# Altium schematic sheet Sheet_1.schdoc
size 273 x 185 mm
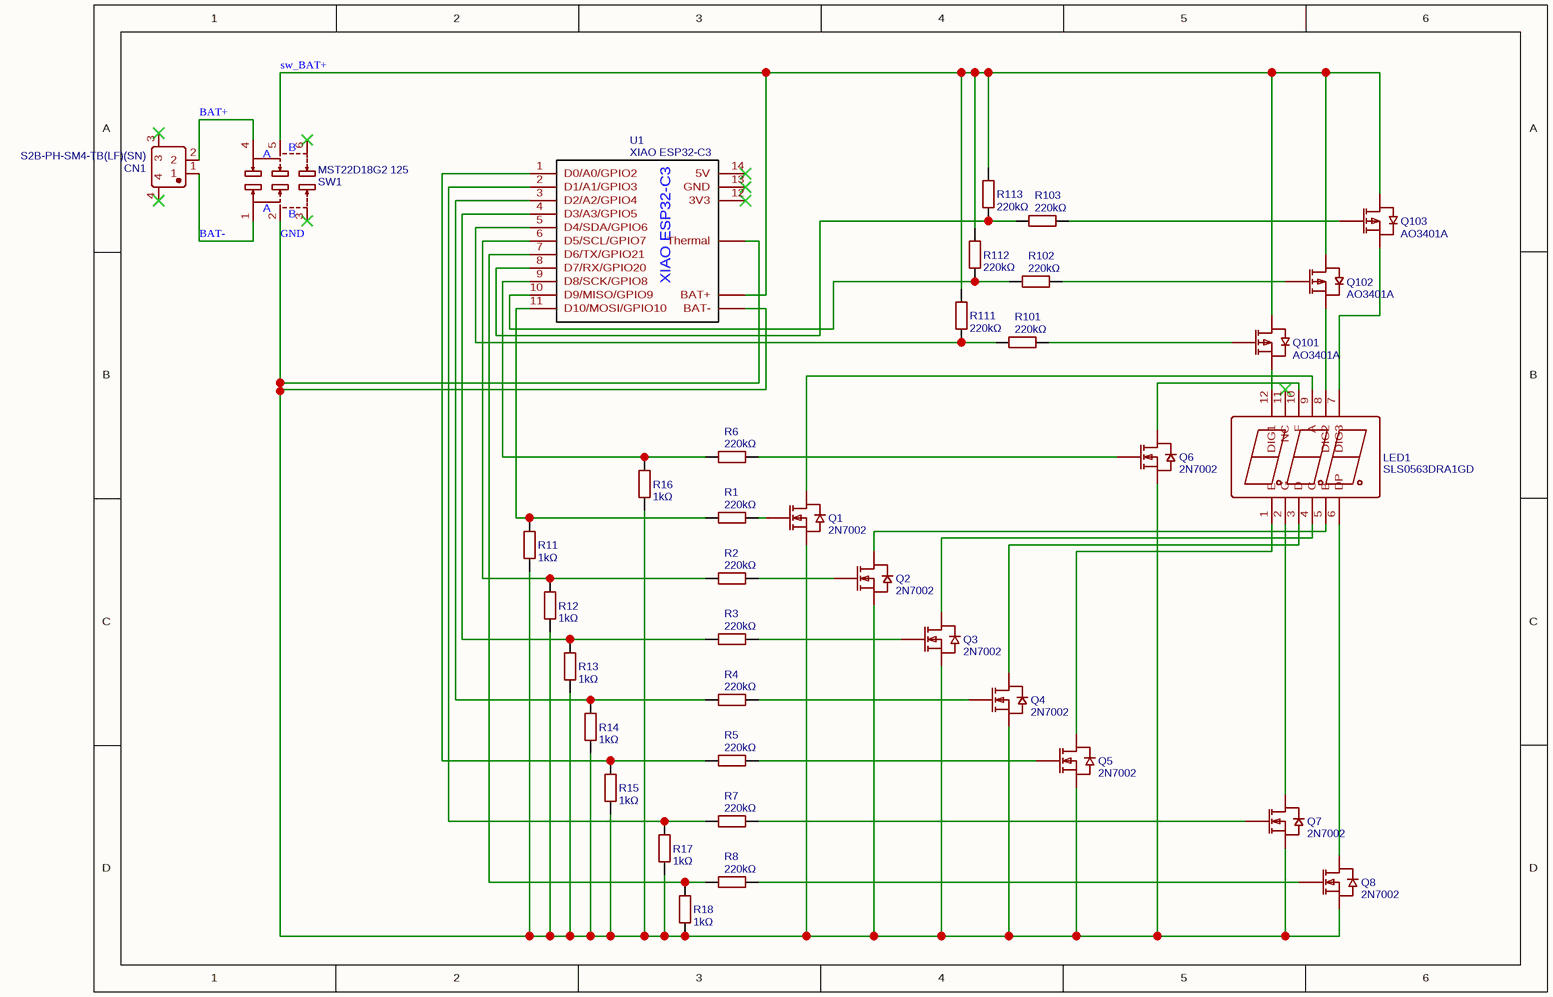
[diagram p0: Sheet_1.schdoc]

## Parts
CN1  S2B-PH-SM4-TB(LF)(SN)  [CONN-SMD_P2.00_S2B-PH-SM4-TB-LF-SN]
LED1  SLS0563DRA1GD  [LED-SEG-SMD_12P-L37.8-W19.0-P2.54-LS19.0-BL]
Q1  2N7002  [SOT-23-3_L2.9-W1.3-P1.90-LS2.4-BR]
Q2  2N7002  [SOT-23-3_L2.9-W1.3-P1.90-LS2.4-BR]
Q3  2N7002  [SOT-23-3_L2.9-W1.3-P1.90-LS2.4-BR]
Q4  2N7002  [SOT-23-3_L2.9-W1.3-P1.90-LS2.4-BR]
Q5  2N7002  [SOT-23-3_L2.9-W1.3-P1.90-LS2.4-BR]
Q6  2N7002  [SOT-23-3_L2.9-W1.3-P1.90-LS2.4-BR]
Q7  2N7002  [SOT-23-3_L2.9-W1.3-P1.90-LS2.4-BR]
Q8  2N7002  [SOT-23-3_L2.9-W1.3-P1.90-LS2.4-BR]
Q101  AO3401A  [SOT-23_L2.9-W1.3-P1.90-LS2.4-BR]
Q102  AO3401A  [SOT-23_L2.9-W1.3-P1.90-LS2.4-BR]
Q103  AO3401A  [SOT-23_L2.9-W1.3-P1.90-LS2.4-BR]
R1  220kΩ  [R0603]
R2  220kΩ  [R0603]
R3  220kΩ  [R0603]
R4  220kΩ  [R0603]
R5  220kΩ  [R0603]
R6  220kΩ  [R0603]
R7  220kΩ  [R0603]
R8  220kΩ  [R0603]
R11  1kΩ  [R0603]
R12  1kΩ  [R0603]
R13  1kΩ  [R0603]
R14  1kΩ  [R0603]
R15  1kΩ  [R0603]
R16  1kΩ  [R0603]
R17  1kΩ  [R0603]
R18  1kΩ  [R0603]
R101  220kΩ  [R0603]
R102  220kΩ  [R0603]
R103  220kΩ  [R0603]
R111  220kΩ  [R0603]
R112  220kΩ  [R0603]
R113  220kΩ  [R0603]
SW1  MST22D18G2 125  [SW-SMD_MST22D18G2]
U1  XIAO ESP32-C3  [MOD-14_22-SMD-L21-W18-P2.54-LS16-TR-EP_XIAO_ESP32C3]

## Nets
BAT+: CN1.2 SW1.4
BAT-: CN1.1 SW1.1
GND: Q1.2(S) Q2.2(S) Q3.2(S) Q4.2(S) Q5.2(S) Q6.2(S) Q7.2(S) Q8.2(S) R11.1 R12.1 R13.1 R14.1 R15.1 R16.1 R17.1 R18.1 SW1.2 U1.BAT- U1.Thermal
sw_BAT+: Q101.3(D) Q102.3(D) Q103.3(D) R111.2 R112.2 R113.2 SW1.5 U1.BAT+
NetLED1_1: LED1.1(E) Q5.3(D)
NetLED1_2: LED1.2(G) Q7.3(D)
NetLED1_3: LED1.3(D) Q4.3(D)
NetLED1_4: LED1.4(C) Q3.3(D)
NetLED1_5: LED1.5(B) Q2.3(D)
NetLED1_6: LED1.6(DP) Q8.3(D)
NetLED1_7: LED1.7(DIG3) Q103.2(S)
NetLED1_8: LED1.8(DIG2) Q102.2(S)
NetLED1_9: LED1.9(A) Q1.3(D)
NetLED1_10: LED1.10(F) Q6.3(D)
NetLED1_12: LED1.12(DIG1) Q101.2(S)
NetQ1_1: Q1.1(G) R1.2
NetQ2_1: Q2.1(G) R2.2
NetQ3_1: Q3.1(G) R3.2
NetQ4_1: Q4.1(G) R4.2
NetQ5_1: Q5.1(G) R5.2
NetQ6_1: Q6.1(G) R6.2
NetQ7_1: Q7.1(G) R7.2
NetQ8_1: Q8.1(G) R8.2
NetQ101_1: Q101.1(G) R101.1
NetQ102_1: Q102.1(G) R102.1
NetQ103_1: Q103.1(G) R103.1
NetR1_1: R1.1 R11.2 U1.11(D10/MOSI/GPIO10)
NetR2_1: R2.1 R12.2 U1.6(D5/SCL/GPIO7)
NetR3_1: R3.1 R13.2 U1.4(D3/A3/GPIO5)
NetR4_1: R4.1 R14.2 U1.3(D2/A2/GPIO4)
NetR5_1: R5.1 R15.2 U1.1(D0/A0/GPIO2)
NetR6_1: R6.1 R16.2 U1.9(D8/SCK/GPIO8)
NetR7_1: R7.1 R17.2 U1.2(D1/A1/GPIO3)
NetR8_1: R8.1 R18.2 U1.7(D6/TX/GPIO21)
NetR101_2: R101.2 R111.1 U1.5(D4/SDA/GPIO6)
NetR102_2: R102.2 R112.1 U1.10(D9/MISO/GPIO9)
NetR103_2: R103.2 R113.1 U1.8(D7/RX/GPIO20)

Not connected (* = marked no-connect by the designer): CN1 3* 4*; LED1 11(NC)*; SW1 3* 6*; U1 12(3V3)* 13(GND)* 14(5V)*

## Notes on the sheet
- (in symbol MST22D18G2 125) B; A

## Library data of the parts
CN1 = S2B-PH-SM4-TB(LF)(SN): BOM_Manufacturer: JST; Contributor: LCSC; BOM_Supplier: LCSC; BOM_Supplier Part: C295747; BOM_Manufacturer Part: S2B-PH-SM4-TB(LF)(SN); BOM_JLCPCB Part Class: Extended Part; spicePre: C; spiceSymbolName: S2B-PH-SM4-TB(LF)(SN)
LED1 = SLS0563DRA1GD: BOM_Manufacturer: SUNLIGHT(光华); Contributor: LCSC; Package Display: No; BOM_Supplier: LCSC; BOM_Supplier Part: C226009; BOM_Manufacturer Part: SLS0563DRA1GD; BOM_JLCPCB Part Class: Extended Part; spicePre: L; spiceSymbolName: SLS0563DRA1GD; pins: A-D10, B-D5, C-D4, D-D3, E-D0, F-D7, G-D2, DP-D6, d1-D10, d2-D9, d3-D8
Q1-Q8 = 2N7002: BOM_Manufacturer: CJ(江苏长电/长晶); BOM_Supplier: LCSC; BOM_Manufacturer Part: 2N7002; BOM_Supplier Part: C8545; BOM_JLCPCB Part Class: Basic Part; spicePre: Q; spiceSymbolName: 2N7002
Q101-Q103 = AO3401A: BOM_Manufacturer: AOS; BOM_Supplier: LCSC; BOM_Manufacturer Part: AO3401A; BOM_Supplier Part: C15127; BOM_JLCPCB Part Class: Basic Part; spicePre: Q; spiceSymbolName: AO3401A
R1-R8 R101-R103 R111-R113 = 220kΩ: BOM_Manufacturer: UNI-ROYAL(厚声); BOM_Manufacturer Part: 0603WAF2203T5E; nameAlias: Resistance; Resistance (Ohms): 220K; BOM_Supplier: LCSC; BOM_Supplier Part: C22961; BOM_JLCPCB Part Class: Basic Part; spicePre: R; spiceSymbolName: 0603WAF2203T5E
R11-R18 = 1kΩ: BOM_Manufacturer: UNI-ROYAL(厚声); BOM_Manufacturer Part: 0603WAF1001T5E; nameAlias: Resistance; Resistance (Ohms): 1K; BOM_Supplier: LCSC; BOM_Supplier Part: C21190; BOM_JLCPCB Part Class: Basic Part; spicePre: R; spiceSymbolName: 0603WAF2203T5E
SW1 = MST22D18G2 125: BOM_Manufacturer: SHOU HAN(首韩); Contributor: LCSC; BOM_Supplier: LCSC; BOM_Supplier Part: C2906280; BOM_Manufacturer Part: MST22D18G2 125; BOM_JLCPCB Part Class: Extended Part; spicePre: S; spiceSymbolName: MST22D18G2 125
U1 = XIAO ESP32-C3: BOM_Manufacturer: Seeed Studio; BOM_Manufacturer Part: XIAO-ESP32C3; Contributor: mlp-easyeda; BOM_Supplier: Seeed Studio; BOM_Supplier Part: XIAO-ESP32C3; link: https://www.seeedstudio.com/Seeed-XIAO-ESP32C3-p-5431.html; spicePre: U; spiceSymbolName: XIAO ESP32-C3